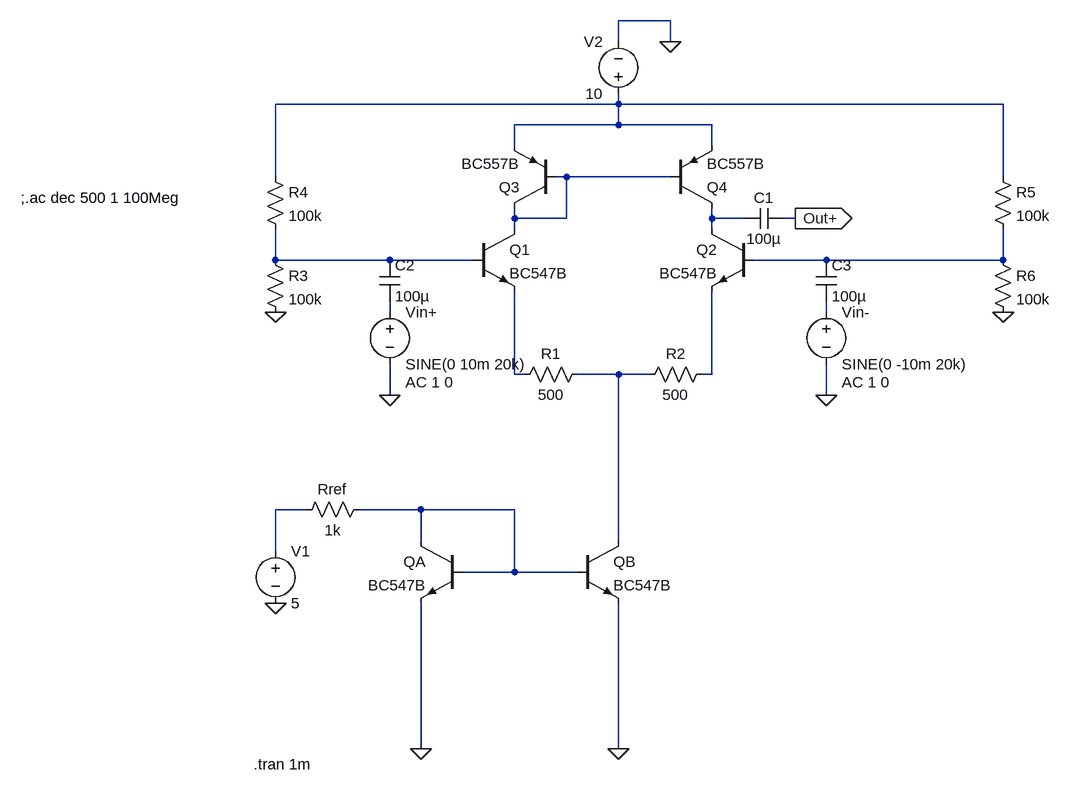
[diagram p0: schematic BJT_Diff_amp_activeLoad3asc.asc]
BJT_Diff_amp_activeLoad3asc.asc, the LTspice schematic file:
Version 4
SHEET 1 948 1044
WIRE 240 -240 160 -240
WIRE 160 -208 160 -240
WIRE 240 -208 240 -240
WIRE 160 -112 160 -128
WIRE 160 -112 -368 -112
WIRE 752 -112 160 -112
WIRE 160 -80 160 -112
WIRE 160 -80 0 -80
WIRE 304 -80 160 -80
WIRE 0 -48 0 -80
WIRE 304 -48 304 -80
WIRE -368 0 -368 -112
WIRE 80 0 64 0
WIRE 240 0 80 0
WIRE 752 0 752 -112
WIRE 0 64 0 48
WIRE 80 64 80 0
WIRE 80 64 0 64
WIRE 304 64 304 48
WIRE 352 64 304 64
WIRE 432 64 416 64
WIRE 0 80 0 64
WIRE 304 80 304 64
WIRE -368 128 -368 80
WIRE -192 128 -368 128
WIRE -64 128 -192 128
WIRE 480 128 368 128
WIRE 752 128 752 80
WIRE 752 128 480 128
WIRE -192 208 -192 192
WIRE 480 208 480 192
WIRE 0 304 0 176
WIRE 16 304 0 304
WIRE 160 304 96 304
WIRE 208 304 160 304
WIRE 304 304 304 176
WIRE 304 304 288 304
WIRE -192 336 -192 288
WIRE 480 336 480 288
WIRE -320 512 -368 512
WIRE -144 512 -240 512
WIRE 0 512 -144 512
WIRE -144 560 -144 512
WIRE 160 560 160 304
WIRE -368 576 -368 512
WIRE 0 608 0 512
WIRE 0 608 -80 608
WIRE 96 608 0 608
WIRE -144 880 -144 656
WIRE 160 880 160 656
FLAG -192 336 0
FLAG 480 336 0
FLAG 240 -208 0
FLAG 432 64 Out+
IOPIN 432 64 Out
FLAG -144 880 0
FLAG 160 880 0
FLAG -368 656 0
FLAG -368 208 0
FLAG 752 208 0
SYMBOL npn 368 80 M0
SYMATTR InstName Q2
SYMATTR Value BC547B
SYMBOL npn -64 80 R0
SYMATTR InstName Q1
SYMATTR Value BC547B
SYMBOL res 112 288 R90
WINDOW 0 0 56 VBottom 2
WINDOW 3 32 56 VTop 2
SYMATTR InstName R1
SYMATTR Value 500
SYMBOL res 304 288 R90
WINDOW 0 0 56 VBottom 2
WINDOW 3 32 56 VTop 2
SYMATTR InstName R2
SYMATTR Value 500
SYMBOL npn 96 560 R0
SYMATTR InstName QB
SYMATTR Value BC547B
SYMBOL npn -80 560 M0
SYMATTR InstName QA
SYMATTR Value BC547B
SYMBOL res -224 496 R90
WINDOW 0 0 56 VBottom 2
WINDOW 3 32 56 VTop 2
SYMATTR InstName Rref
SYMATTR Value 1k
SYMBOL voltage 160 -112 R180
WINDOW 0 24 96 Left 2
WINDOW 3 24 16 Left 2
WINDOW 123 0 0 Left 0
WINDOW 39 0 0 Left 0
SYMATTR InstName V2
SYMATTR Value 10
SYMBOL voltage -192 192 R0
WINDOW 123 24 124 Left 2
WINDOW 39 0 0 Left 0
SYMATTR InstName Vin+
SYMATTR Value SINE(0 10m 20k)
SYMATTR Value2 AC 1 0
SYMBOL voltage 480 192 R0
WINDOW 123 24 124 Left 2
WINDOW 39 0 0 Left 0
SYMATTR InstName Vin-
SYMATTR Value SINE(0 -10m 20k)
SYMATTR Value2 AC 1 0
SYMBOL pnp 64 48 R180
SYMATTR InstName Q3
SYMATTR Value BC557B
SYMBOL pnp 240 48 M180
SYMATTR InstName Q4
SYMATTR Value BC557B
SYMBOL voltage -368 560 R0
WINDOW 123 0 0 Left 0
WINDOW 39 0 0 Left 0
SYMATTR InstName V1
SYMATTR Value 5
SYMBOL cap 416 48 R90
WINDOW 0 0 32 VBottom 2
WINDOW 3 32 32 VTop 2
SYMATTR InstName C1
SYMATTR Value 100µ
SYMBOL cap -208 128 R0
SYMATTR InstName C2
SYMATTR Value 100µ
SYMBOL cap 464 128 R0
SYMATTR InstName C3
SYMATTR Value 100µ
SYMBOL res -384 112 R0
SYMATTR InstName R3
SYMATTR Value 100k
SYMBOL res -384 -16 R0
SYMATTR InstName R4
SYMATTR Value 100k
SYMBOL res 736 -16 R0
SYMATTR InstName R5
SYMATTR Value 100k
SYMBOL res 736 112 R0
SYMATTR InstName R6
SYMATTR Value 100k
TEXT -402 904 Left 2 !.tran 1m
TEXT -760 32 Left 2 !;.ac dec 500 1 100Meg

The netlist it stands for:
* BJT_Diff_amp_activeLoad3asc.asc
Q2 N003 N005 N010 0 BC547B
Q1 N002 N004 N008 0 BC547B
R1 N009 N008 500
R2 N010 N009 500
QB N009 N012 0 0 BC547B
QA N012 N012 0 0 BC547B
Rref N012 N011 1k
V2 N001 0 10
Vin+ N006 0 SINE(0 10m 20k) AC 1 0
Vin- N007 0 SINE(0 -10m 20k) AC 1 0
Q3 N002 N002 N001 0 BC557B
Q4 N003 N002 N001 0 BC557B
V1 N011 0 5
C1 Out+ N003 100µ
C2 N004 N006 100µ
C3 N005 N007 100µ
R3 N004 0 100k
R4 N001 N004 100k
R5 N001 N005 100k
R6 N005 0 100k
.model NPN NPN
.model PNP PNP
.lib standard.bjt
.tran 1m
;.ac dec 500 1 100Meg
.backanno
.end